# EAGLE design HBPB_FM_v4 (EAGLE 8.6.2)
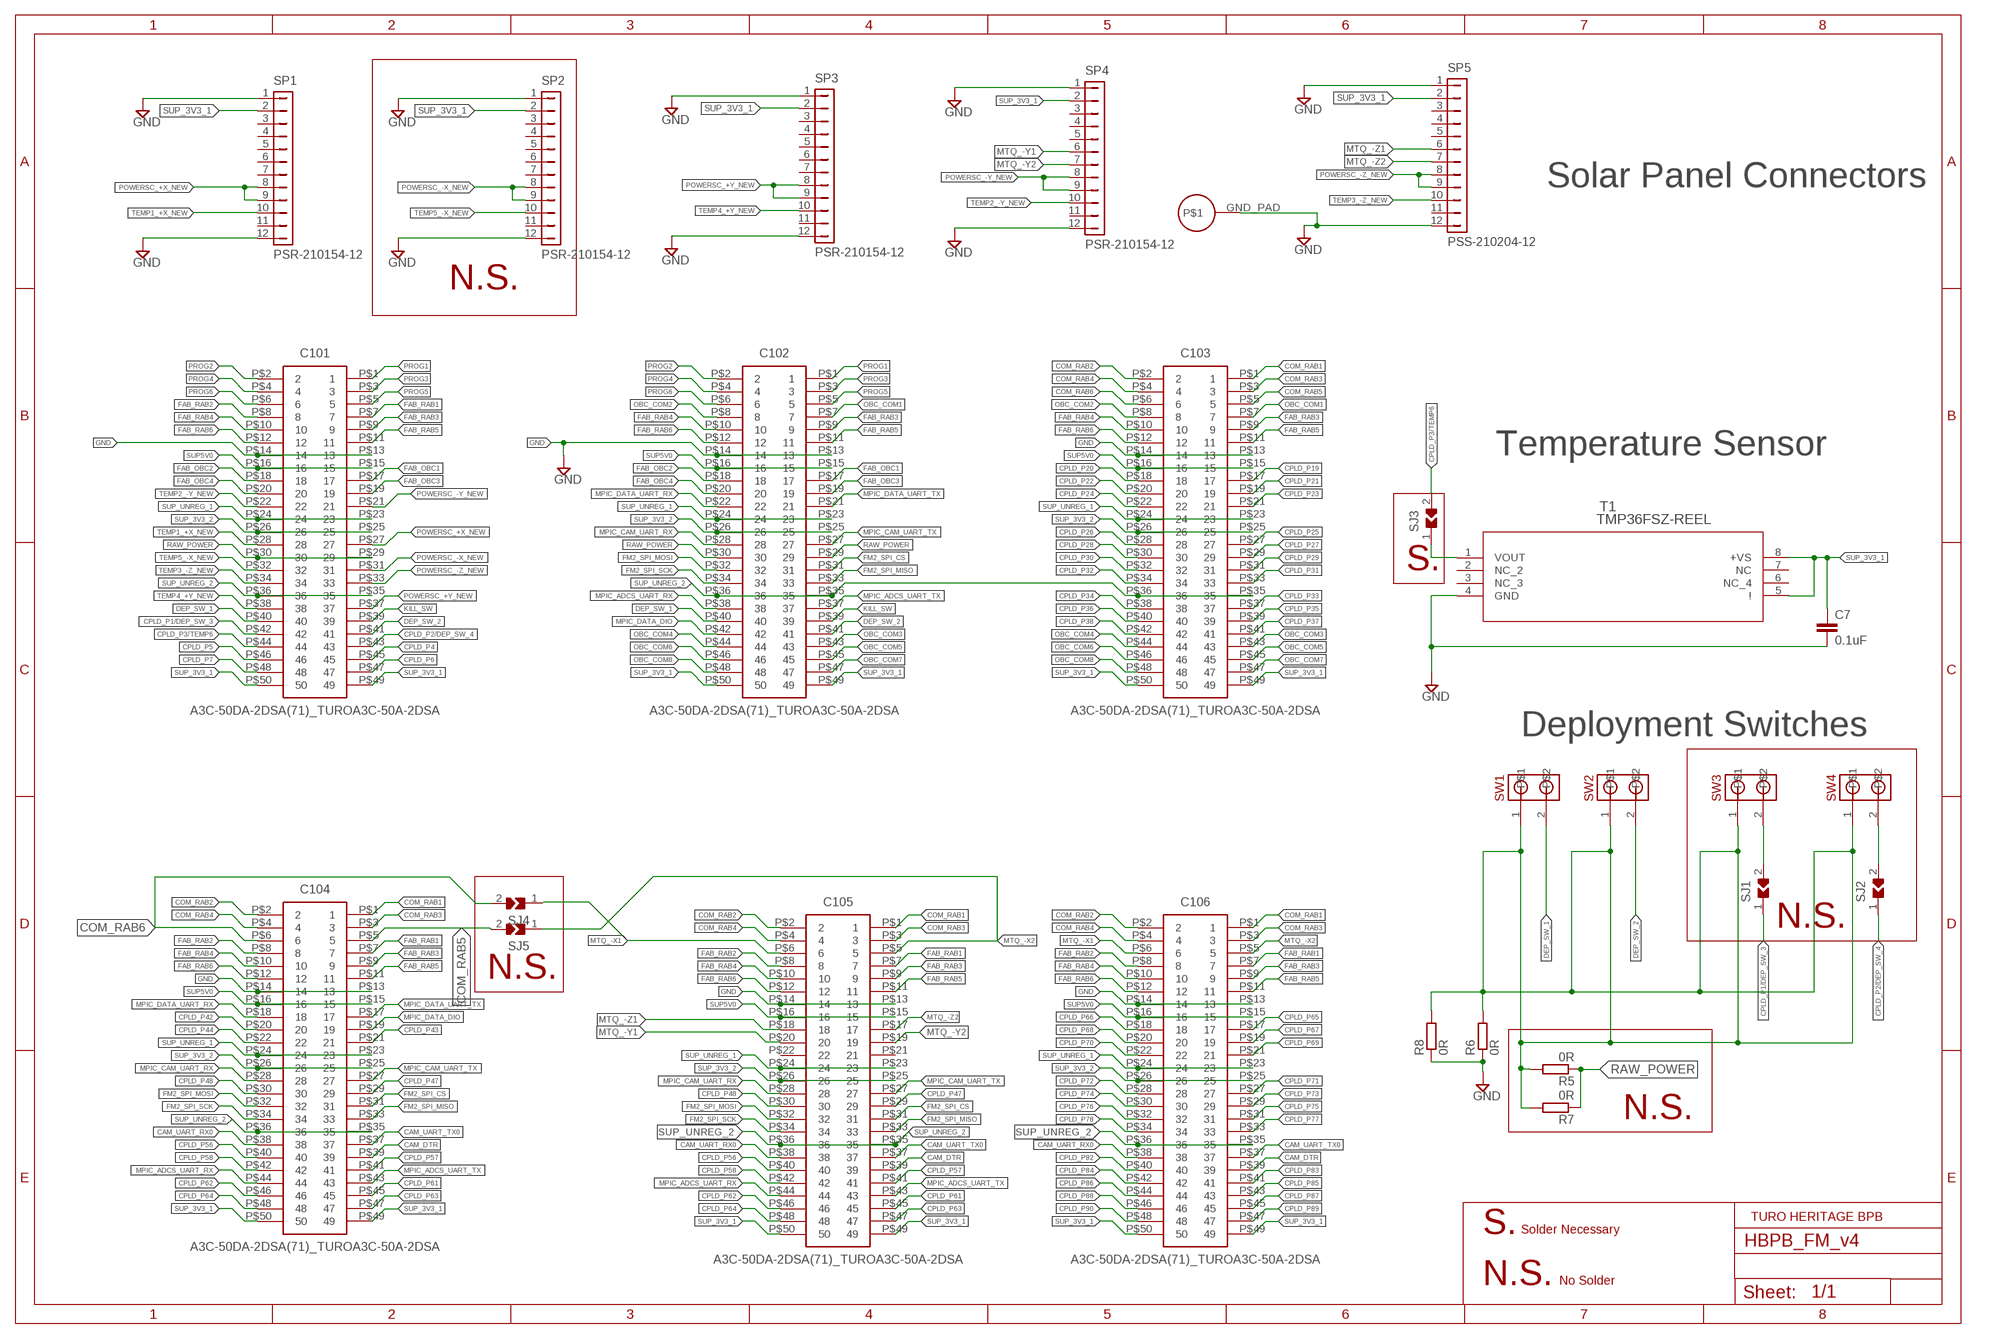
[diagram p0: schematic, sheet 1]

## Parts
C7  0.1uF  CC0402  [C0402]
C101  A3C-50DA-2DSA(71)_TUROA3C-50A-2DSA  [SHDR50W60P200_2X25_5000X400X44_TR]
C102  A3C-50DA-2DSA(71)_TUROA3C-50A-2DSA  [SHDR50W60P200_2X25_5000X400X44_TR]
C103  A3C-50DA-2DSA(71)_TUROA3C-50A-2DSA  [SHDR50W60P200_2X25_5000X400X44_TR]
C104  A3C-50DA-2DSA(71)_TUROA3C-50A-2DSA  [SHDR50W60P200_2X25_5000X400X44_TR]
C105  A3C-50DA-2DSA(71)_TUROA3C-50A-2DSA  [SHDR50W60P200_2X25_5000X400X44_TR]
C106  A3C-50DA-2DSA(71)_TUROA3C-50A-2DSA  [SHDR50W60P200_2X25_5000X400X44_TR]
R5  0R  RR3216  [R3216]
R6  0R  RR3216  [R3216]
R7  0R  RR3216  [R3216]
R8  0R  RR3216  [R3216]
SJ1  SJ_BY_TURO  [SJ_TURO]
SJ2  0R  SJ_BY_TURO  [SJ_TURO]
SJ3  SJ_BY_TURO  [SJ_TURO]
SJ4  SJ_BY_TURO  [SJ_TURO]
SJ5  SJ_BY_TURO  [SJ_TURO]
SP1  PSR-210154-12  [PIN1X12/90]
SP2  PSR-210154-12  [PIN1X12/90]
SP3  PSR-210154-12  [PIN1X12/90]
SP4  PSR-210154-12  [PIN1X12/90]
SP5  PSS-210204-12  [PIN1X12]
SW1  MOLEX-CONN-2-0554600272  [MOLEX-CONN-2-BIRDS]
SW2  MOLEX-CONN-2-0554600272  [MOLEX-CONN-2-BIRDS]
SW3  MOLEX-CONN-2-0554600272  [MOLEX-CONN-2-BIRDS]
SW4  MOLEX-CONN-2-0554600272  [MOLEX-CONN-2-BIRDS]
T1  TMP36FSZ-REEL  [R_8]
U$1  GND_PAD  [GND_PAD]

## Nets
CAM_DTR: C104.P$39 C105.P$39 C106.P$39
CAM_UART_RX0: C104.P$38 C105.P$38 C106.P$38
CAM_UART_TX0: C104.P$37 C105.P$37 C106.P$37
COM_RAB1: C103.P$1 C104.P$1 C105.P$1 C106.P$1
COM_RAB2: C103.P$2 C104.P$2 C105.P$2 C106.P$2
COM_RAB3: C103.P$3 C104.P$3 C105.P$3 C106.P$3
COM_RAB4: C103.P$4 C104.P$4 C105.P$4 C106.P$4
COM_RAB5: C103.P$5 C104.P$5 SJ5.2
COM_RAB6: C103.P$6 C104.P$6 SJ4.2
CPLD_P1/DEP_SW_3: C101.P$42 SJ1.1
CPLD_P2/DEP_SW_4: C101.P$43 SJ2.1
CPLD_P3/TEMP6: C101.P$44 SJ3.2
CPLD_P4: C101.P$45
CPLD_P5: C101.P$46
CPLD_P6: C101.P$47
CPLD_P7: C101.P$48
CPLD_P19: C103.P$17
CPLD_P20: C103.P$18
CPLD_P21: C103.P$19
CPLD_P22: C103.P$20
CPLD_P23: C103.P$21
CPLD_P24 [POWER]: C103.P$22
CPLD_P25: C103.P$27
CPLD_P26: C103.P$28
CPLD_P27: C103.P$29
CPLD_P28: C103.P$30
CPLD_P29: C103.P$31
CPLD_P30: C103.P$32
CPLD_P31: C103.P$33
CPLD_P32: C103.P$34
CPLD_P33: C103.P$37
CPLD_P34: C103.P$38
CPLD_P35: C103.P$39
CPLD_P36: C103.P$40
CPLD_P37: C103.P$41
CPLD_P38: C103.P$42
CPLD_P42: C104.P$20
CPLD_P43: C104.P$21
CPLD_P44: C104.P$22
CPLD_P47: C104.P$29 C105.P$29
CPLD_P48: C104.P$30 C105.P$30
CPLD_P56: C104.P$40 C105.P$40
CPLD_P57: C104.P$41 C105.P$41
CPLD_P58: C104.P$42 C105.P$42
CPLD_P61: C104.P$45 C105.P$45
CPLD_P62: C104.P$46 C105.P$46
CPLD_P63: C104.P$47 C105.P$47
CPLD_P64: C104.P$48 C105.P$48
CPLD_P65: C106.P$17
CPLD_P66: C106.P$18
CPLD_P67: C106.P$19
CPLD_P68: C106.P$20
CPLD_P69: C106.P$21
CPLD_P70: C106.P$22
CPLD_P71: C106.P$27
CPLD_P72: C106.P$28
CPLD_P73: C106.P$29
CPLD_P74: C106.P$30
CPLD_P75: C106.P$31
CPLD_P76: C106.P$32
CPLD_P77: C106.P$33
CPLD_P78: C106.P$34
CPLD_P82: C106.P$40
CPLD_P83: C106.P$41
CPLD_P84: C106.P$42
CPLD_P85: C106.P$43
CPLD_P86: C106.P$44
CPLD_P87: C106.P$45
CPLD_P88: C106.P$46
CPLD_P89: C106.P$47
CPLD_P90: C106.P$48
DEP_SW_1: C101.P$40 C102.P$40 SW1.2
DEP_SW_2: C101.P$41 C102.P$41 SW2.2
DEP_SW_POWER: R5.2 R6.2 R7.2 R8.2 SW1.1 SW2.1 SW3.1 SW4.1
FAB_OBC1: C101.P$17 C102.P$17
FAB_OBC2: C101.P$18 C102.P$18
FAB_OBC3: C101.P$19 C102.P$19
FAB_OBC4: C101.P$20 C102.P$20
FAB_RAB1: C101.P$7 C104.P$7 C105.P$7 C106.P$7
FAB_RAB2: C101.P$8 C104.P$8 C105.P$8 C106.P$8
FAB_RAB3: C101.P$9 C102.P$9 C103.P$9 C104.P$9 C105.P$9 C106.P$9
FAB_RAB4: C101.P$10 C102.P$10 C103.P$10 C104.P$10 C105.P$10 C106.P$10
FAB_RAB5: C101.P$11 C102.P$11 C103.P$11 C104.P$11 C105.P$11 C106.P$11
FAB_RAB6: C101.P$12 C102.P$12 C103.P$12 C104.P$12 C105.P$12 C106.P$12
FM2_SPI_CS: C102.P$31 C104.P$31 C105.P$31
FM2_SPI_MISO: C102.P$33 C104.P$33 C105.P$33
FM2_SPI_MOSI: C102.P$32 C104.P$32 C105.P$32
FM2_SPI_SCK: C102.P$34 C104.P$34 C105.P$34
GND [GND]: C7.2 C101.P$13 C101.P$14 C102.P$13 C102.P$14 C103.P$13 C103.P$14 C104.P$13 C104.P$14 C105.P$13 C105.P$14 C106.P$13 C106.P$14 R6.1 R8.1 SP1.1 SP1.12 SP2.1 SP2.12 SP3.1 SP3.12 SP4.1 SP4.12 SP5.1 SP5.12 T1.4(GND) U$1.GND_PAD
KILL_SW: C101.P$39 C102.P$39
MPIC_ADCS_UART_RX: C102.P$38 C104.P$44 C105.P$44
MPIC_ADCS_UART_TX: C102.P$37 C104.P$43 C105.P$43
MPIC_CAM_UART_RX: C102.P$28 C104.P$28 C105.P$28
MPIC_CAM_UART_TX: C102.P$27 C104.P$27 C105.P$27
MPIC_DATA_DIO: C102.P$42 C104.P$19
MPIC_DATA_UART_RX: C102.P$22 C104.P$18
MPIC_DATA_UART_TX: C102.P$21 C104.P$17
MTQ_-X1: C105.P$6 C106.P$6 SJ4.1
MTQ_-X2: C105.P$5 C106.P$5 SJ5.1
MTQ_-Y1: C105.P$20 SP4.6
MTQ_-Y2: C105.P$19 SP4.7
MTQ_-Z1: C105.P$18 SP5.6
MTQ_-Z2: C105.P$17 SP5.7
N$8: SJ2.2 SW4.2
N$9: SJ1.2 SW3.2
N$13: SJ3.1 T1.1(VOUT)
OBC_COM1: C102.P$7 C103.P$7
OBC_COM2: C102.P$8 C103.P$8
OBC_COM3: C102.P$43 C103.P$43
OBC_COM4: C102.P$44 C103.P$44
OBC_COM5: C102.P$45 C103.P$45
OBC_COM6: C102.P$46 C103.P$46
OBC_COM7: C102.P$47 C103.P$47
OBC_COM8: C102.P$48 C103.P$48
POWERSC_+X_NEW [POWER]: C101.P$27 SP1.8 SP1.9
POWERSC_+Y_NEW [POWER]: C101.P$37 SP3.8 SP3.9
POWERSC_-X_NEW [POWER]: C101.P$31 SP2.8 SP2.9
POWERSC_-Y_NEW [POWER]: C101.P$21 SP4.8 SP4.9
POWERSC_-Z_NEW [POWER]: C101.P$33 SP5.8 SP5.9
PROG1: C101.P$1 C102.P$1
PROG2: C101.P$2 C102.P$2
PROG3: C101.P$3 C102.P$3
PROG4: C101.P$4 C102.P$4
PROG5: C101.P$5 C102.P$5
PROG6: C101.P$6 C102.P$6
RAW_POWER: C101.P$29 C101.P$30 C102.P$29 C102.P$30 R5.1 R7.1
SUP5V0 [POWER]: C101.P$15 C101.P$16 C102.P$15 C102.P$16 C103.P$15 C103.P$16 C104.P$15 C104.P$16 C105.P$15 C105.P$16 C106.P$15 C106.P$16
SUP_3V3_1 [POWER]: C7.1 C101.P$49 C101.P$50 C102.P$49 C102.P$50 C103.P$49 C103.P$50 C104.P$49 C104.P$50 C105.P$49 C105.P$50 C106.P$49 C106.P$50 SP1.2 SP2.2 SP3.2 SP4.2 SP5.2 T1.5(!) T1.8(+VS)
SUP_3V3_2 [POWER]: C101.P$25 C101.P$26 C102.P$25 C102.P$26 C103.P$25 C103.P$26 C104.P$25 C104.P$26 C105.P$25 C105.P$26 C106.P$25 C106.P$26
SUP_UNREG_1 [POWER]: C101.P$23 C101.P$24 C102.P$23 C102.P$24 C103.P$23 C103.P$24 C104.P$23 C104.P$24 C105.P$23 C105.P$24 C106.P$23 C106.P$24
SUP_UNREG_2 [POWER]: C101.P$35 C101.P$36 C102.P$35 C102.P$36 C103.P$35 C103.P$36 C104.P$35 C104.P$36 C105.P$35 C105.P$36 C106.P$35 C106.P$36
TEMP1_+X_NEW: C101.P$28 SP1.10
TEMP2_-Y_NEW: C101.P$22 SP4.10
TEMP3_-Z_NEW: C101.P$34 SP5.10
TEMP4_+Y_NEW: C101.P$38 SP3.10
TEMP5_-X_NEW: C101.P$32 SP2.10
Unconnected: C105.P$21 C105.P$22 SP1.3 SP1.4 SP1.5 SP1.6 SP1.7 SP1.11 SP2.3 SP2.4 SP2.5 SP2.6 SP2.7 SP2.11 SP3.3 SP3.4 SP3.5 SP3.6 SP3.7 SP3.11 SP4.3 SP4.4 SP4.5 SP4.11 SP5.3 SP5.4 SP5.5 SP5.11 T1.2(NC_2) T1.3(NC_3) T1.6(NC_4) T1.7(NC)

## Notes on the sheet
- Solar Panel Connectors
- N.S.
- Temperature Sensor
- S.
- Deployment Switches
- N.S.
- N.S.
- N.S.
- TURO HERITAGE BPB
- S. | Solder Necessary
- N.S. | No Solder

## Library data of the parts
C7 = Turo_collection:C: CAPACITOR, European symbol; SPICEMODEL: NONE; SPICEPREFIX: C
C101-C106 = Turo_collection:A3C-50DA-2DSA(71)_TURO: Hirose A3C Series 2mm 50 Way 2 Row Straight PCB Socket Through Hole Board to Wire <http://uk.rs-online.com/largeimages/R7793068-01.jpg> Source: Datasheet <https://www.google.co.uk/url?sa=t&rct=j&q=&esrc=s&source=web&cd=5&ved=0ahUKEwiW7Ov7l8PWAhUDCsAKHbxmCjsQFgg9MAQ&url=https://www.hirose.com/product/en/download_file/key_name/A3/category/Catalog/doc_file_id/49521/?file_category_id>
R5-R8 = Turo_collection:R: RESISTOR, European symbol; SPICEMODEL: NONE; SPICEPREFIX: R
SJ1-SJ5 = Turo_collection:SJ_BY_TURO
SP1-SP4 = Turo_collection:PSR-210154-12
SP5 = Turo_collection:PSS-210204-12: Used for -Z panel on the backplane Created by Turo - 2018
SW1-SW4 = Turo_collection:MOLEX-CONN-2-0554600272
T1 = Turo_collection:TMP36FSZ-REEL; MANUFACTURER_PART_NUMBER: TMP36FSZREEL; VENDOR: Analog Devices Inc
U$1 = Turo_collection:GND_PAD

## Net classes
1 GND: width 0.2 mm, clearance 0.127 mm
2 POWER: width 0.2 mm, clearance 0.02 mm

## Board
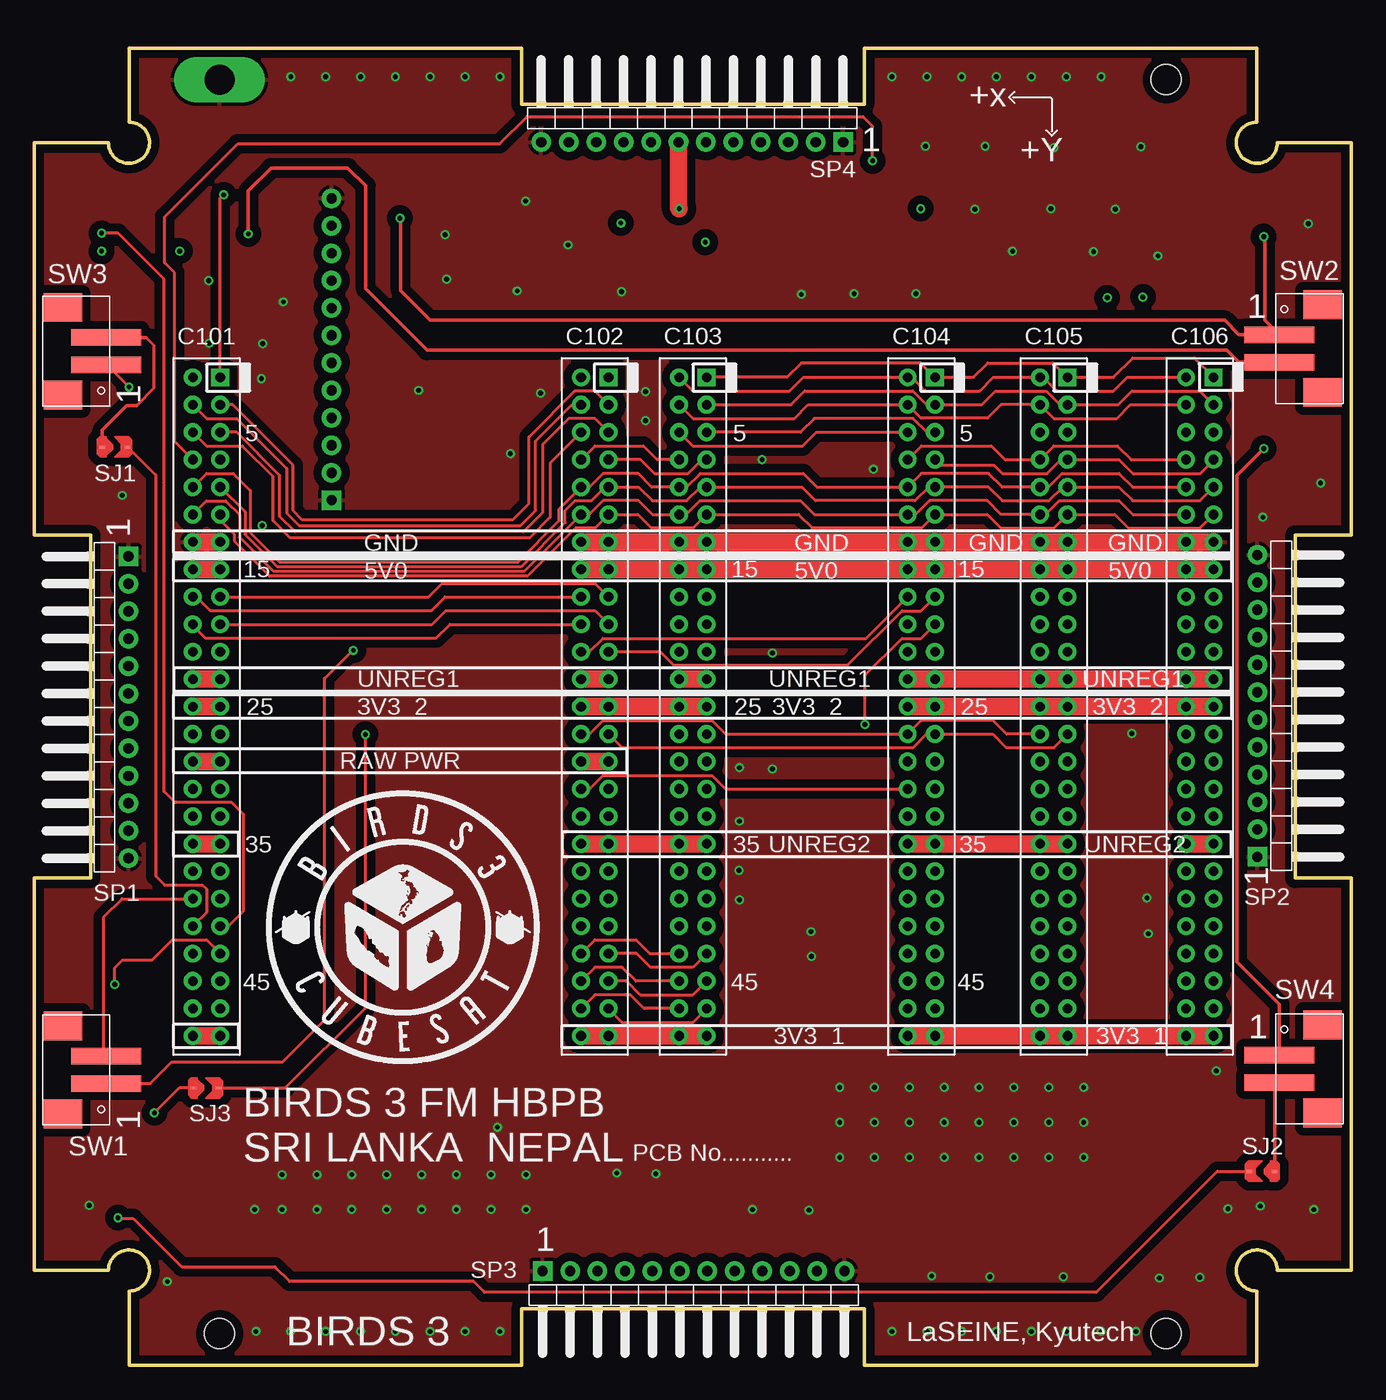
[diagram p1: board, top side]
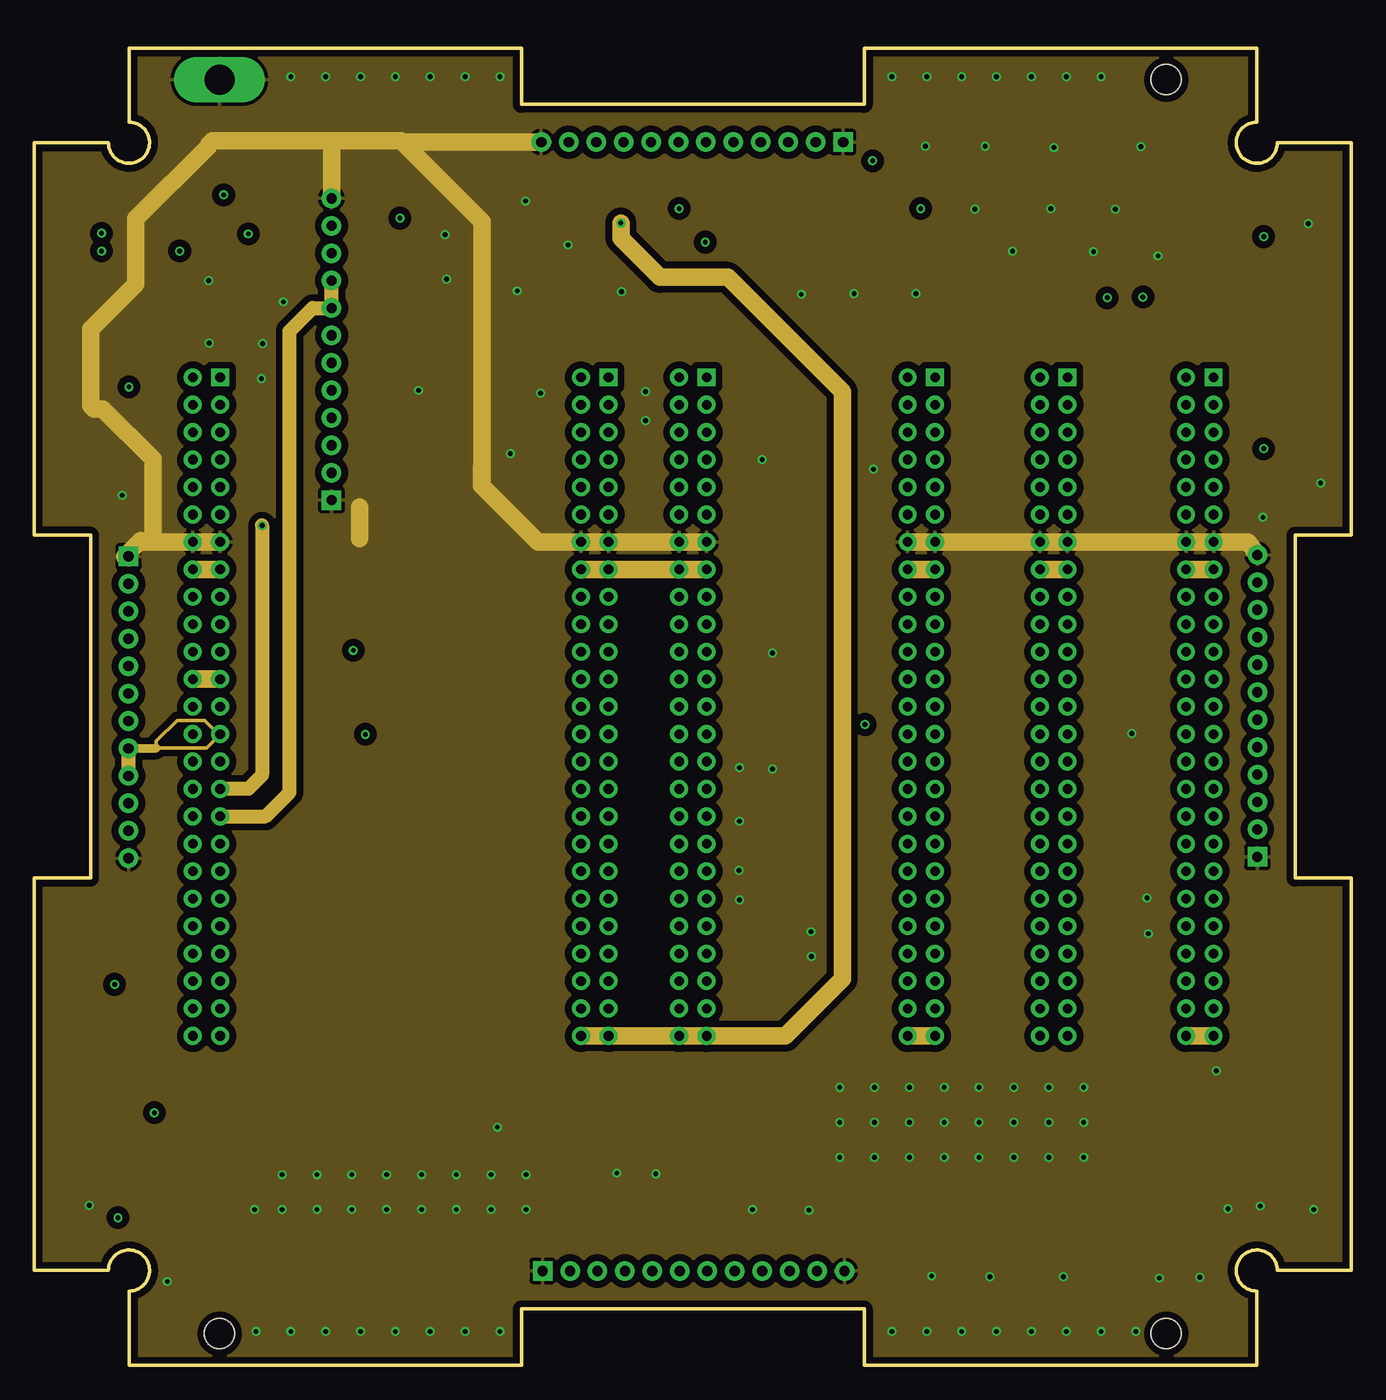
[diagram p2: board, inner layer L2_GND]
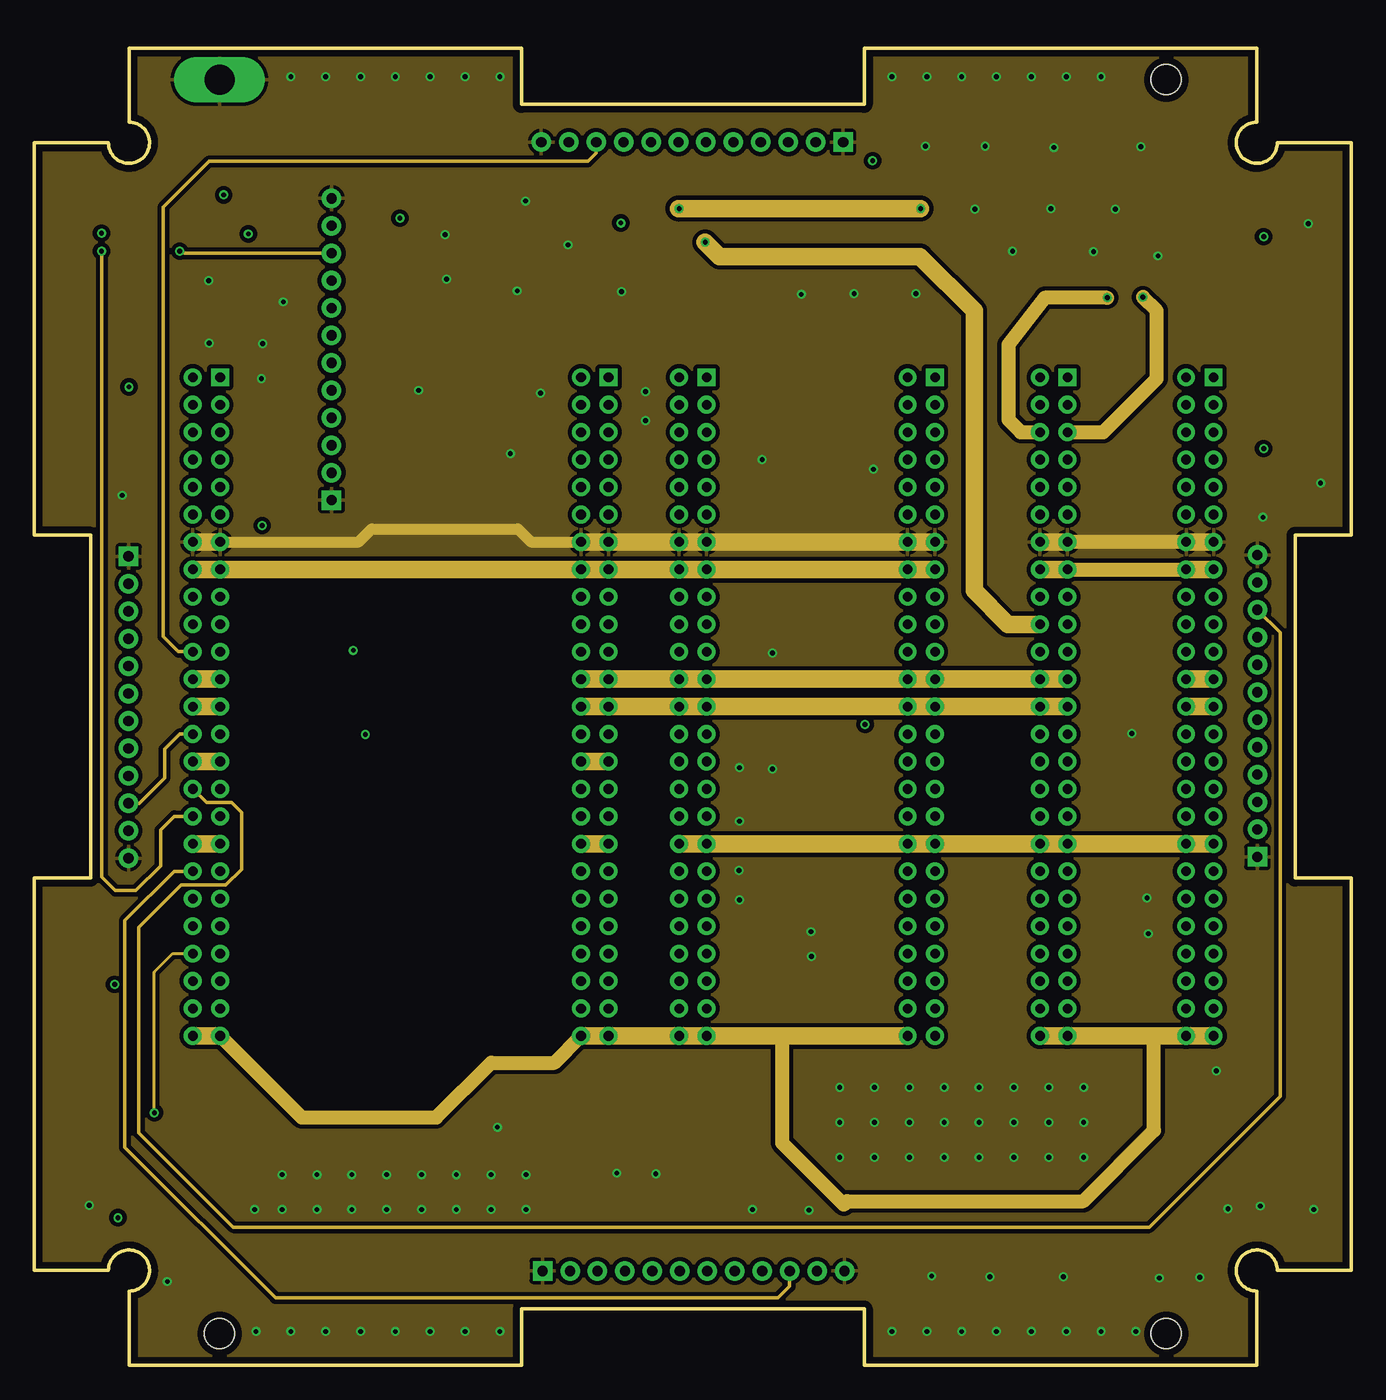
[diagram p3: board, inner layer L3]
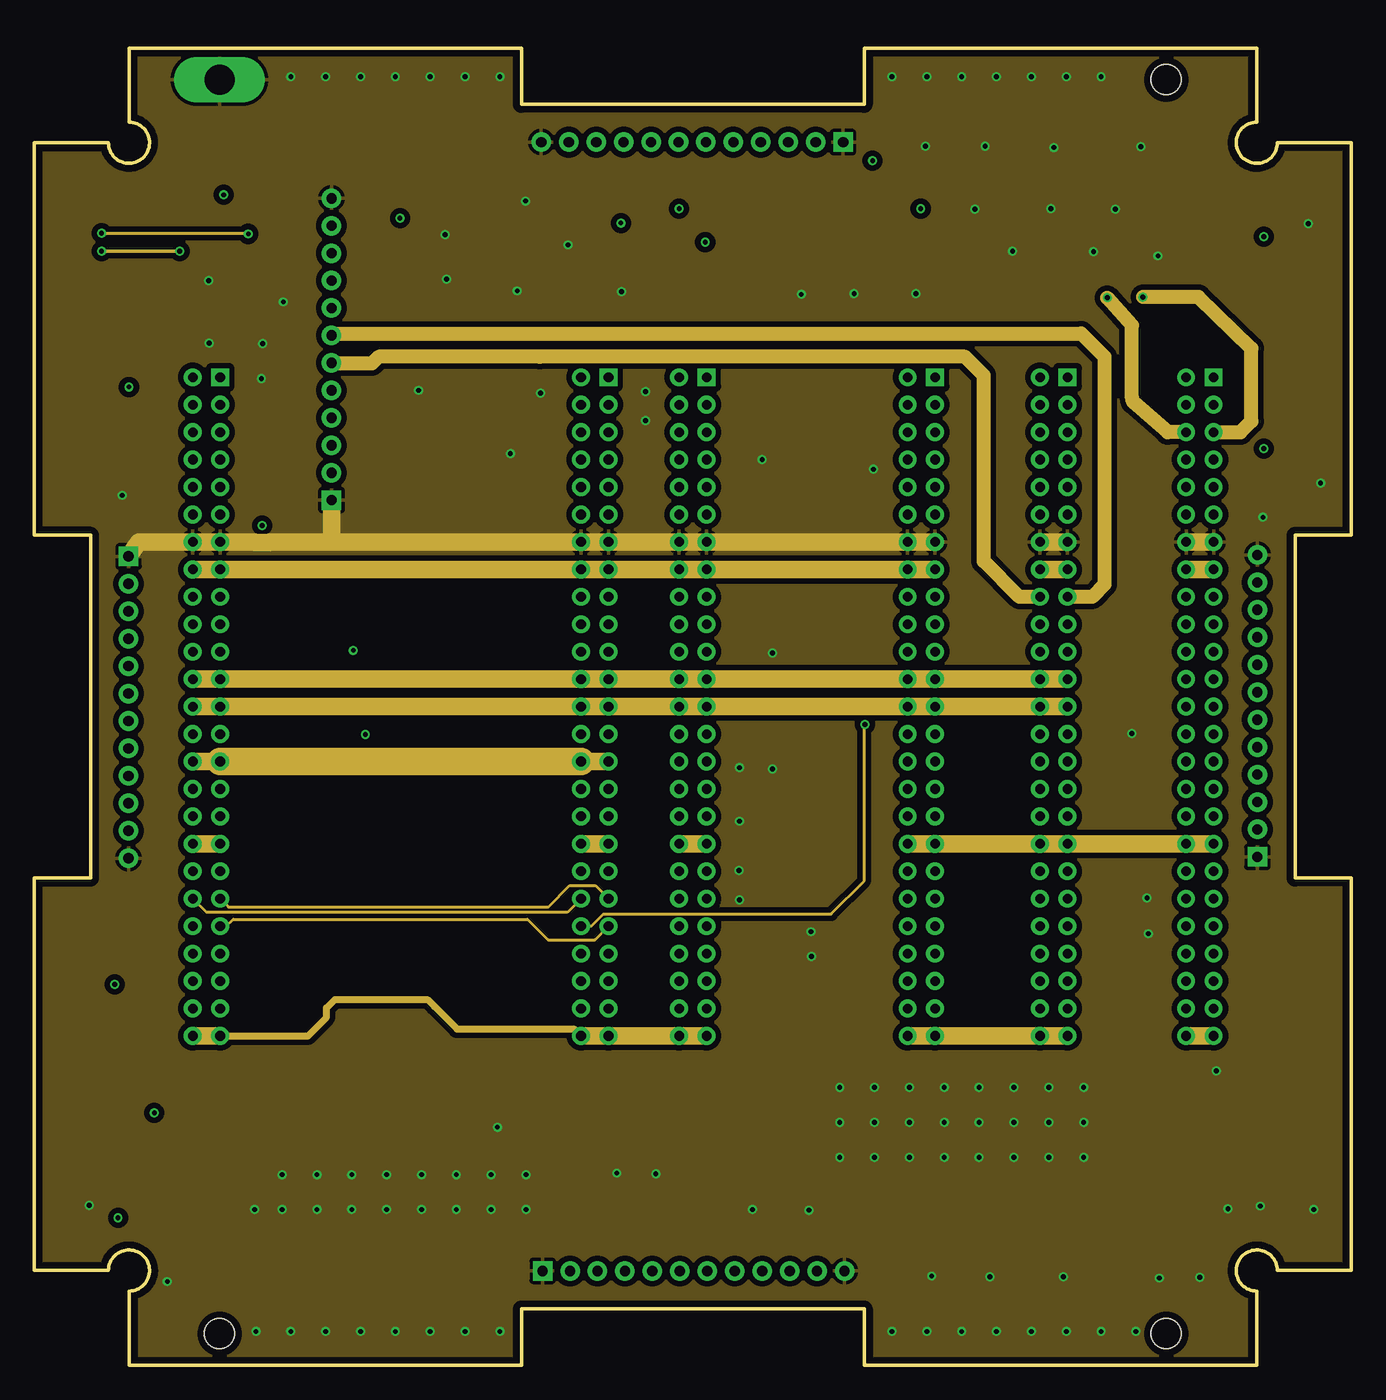
[diagram p4: board, inner layer L4]
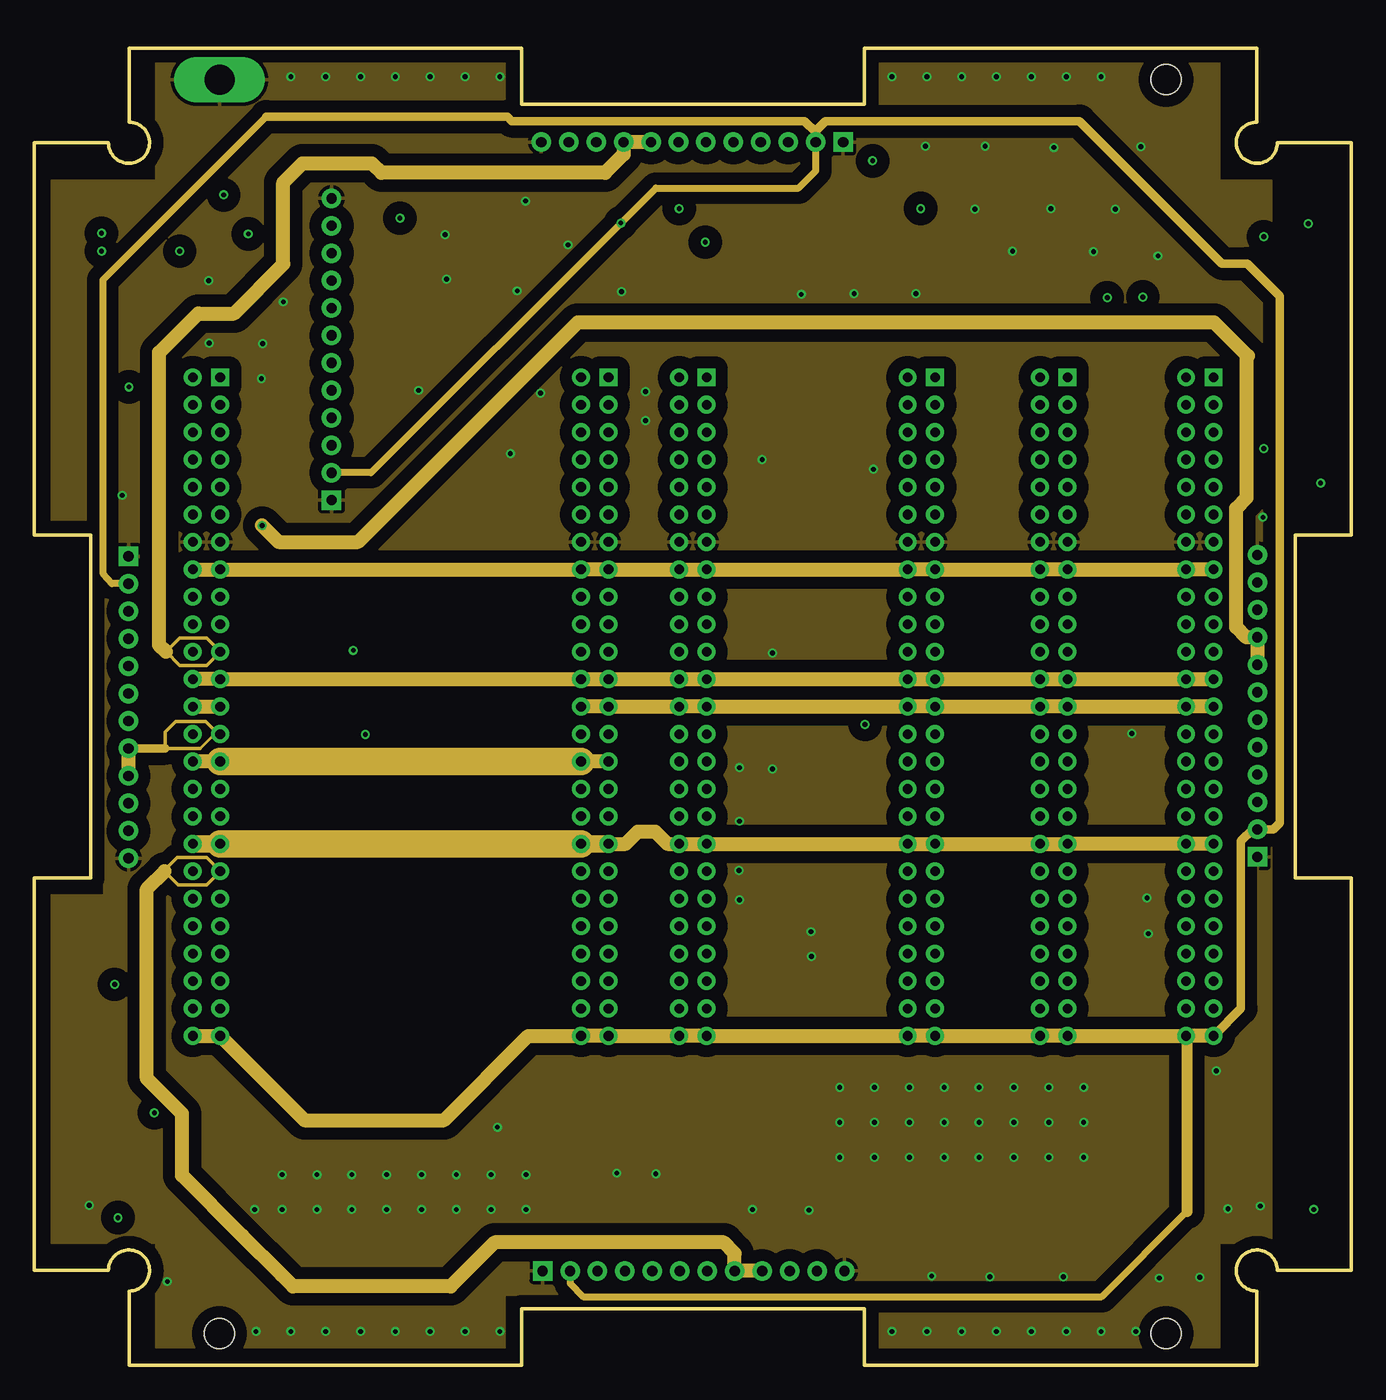
[diagram p5: board, inner layer L5_VCC]
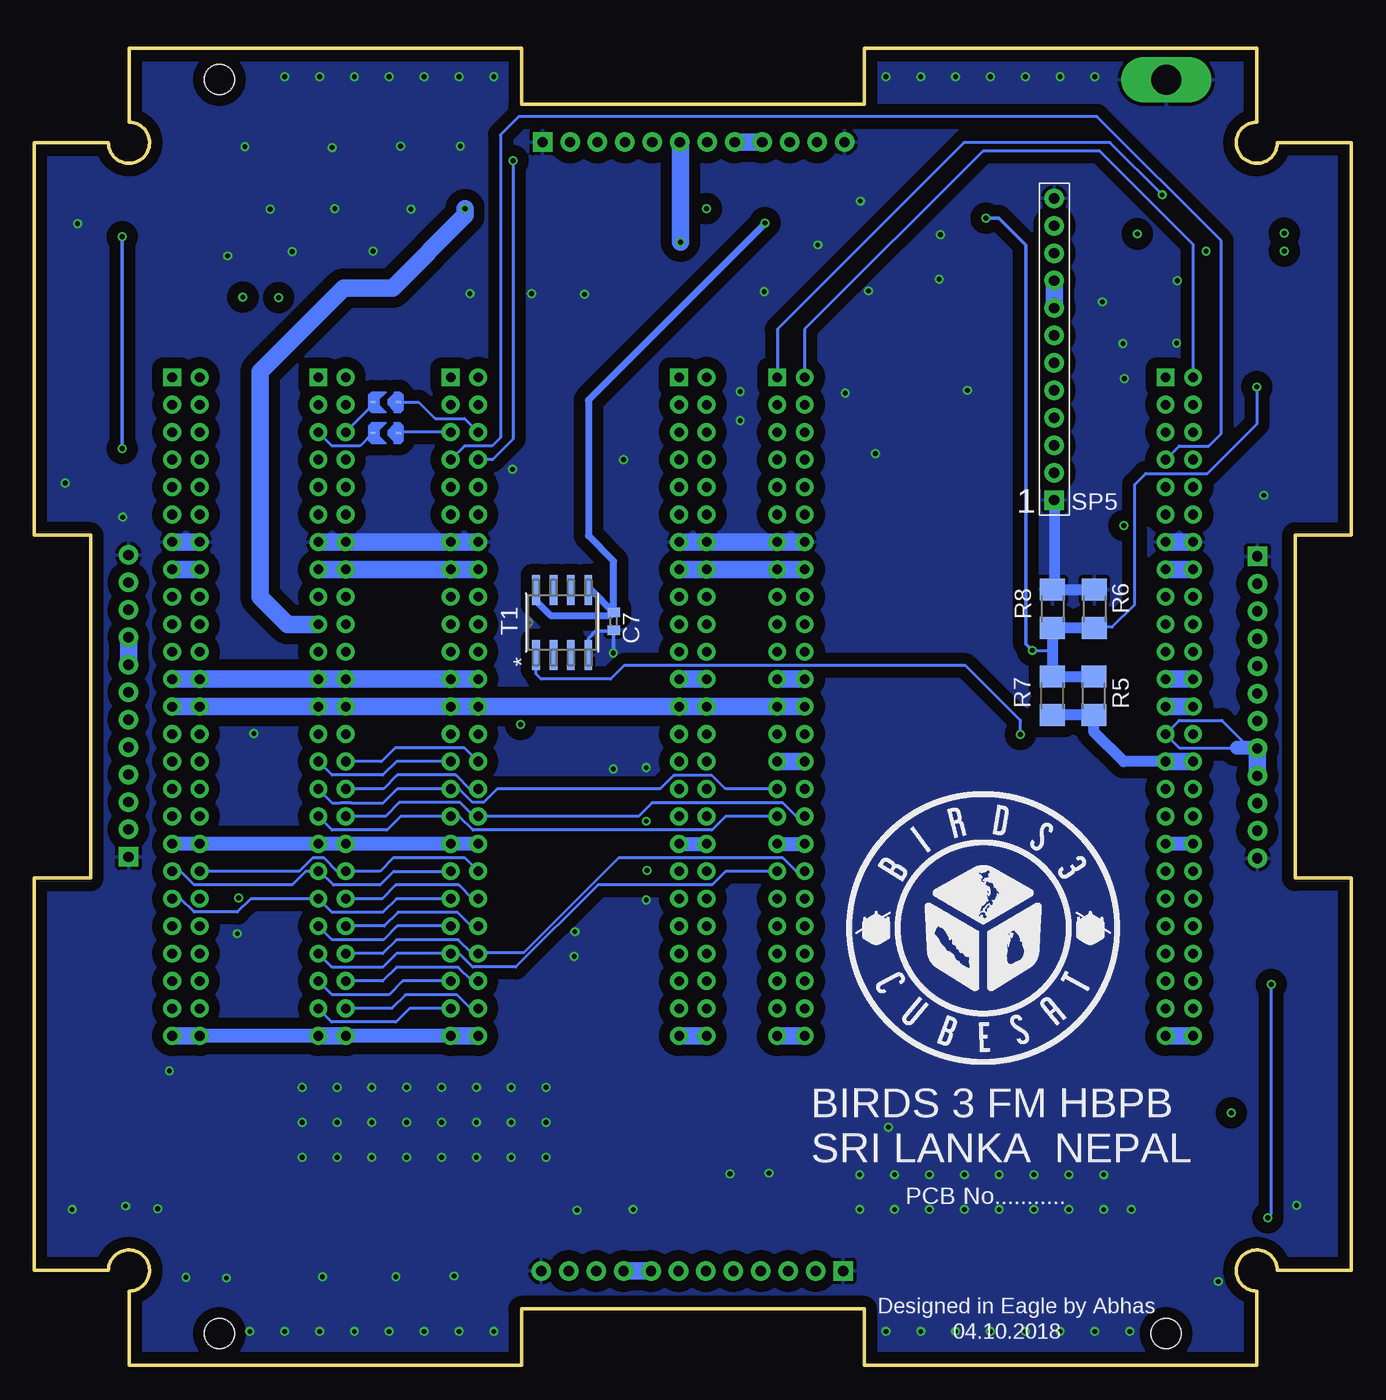
[diagram p6: board, bottom side, seen from below]

Size 96 x 96 mm. Coordinates in mm from the lower left corner, seen from the top.
Outline: 0,6.9 0,35.5 4.1,35.5 4.1,60.5 0,60.5 0,89.1 5.4,89.1 arc270 6.9,90.6 6.9,96 35.5,96 35.5,91.9 60.5,91.9 60.5,96 89.1,96 89.1,90.6 arc270 90.6,89.1 96,89.1 96,60.5 91.9,60.5 91.9,35.5 96,35.5 96,6.9 90.6,6.9 arc270 89.1,5.4 89.1,0 60.5,0 60.5,4.1 35.5,4.1 35.5,0 6.9,0 6.9,5.4 arc270 5.4,6.9 0,6.9
Copper layers (1+2*3*5*15+16): L1 0.018mm / dielectric 0.25mm / L2_GND 0.035mm / dielectric 0.25mm / L3 0.035mm / dielectric 0.2mm / L4 0.035mm / dielectric 0.2mm / L5_VCC 0.035mm / dielectric 0.25mm / L6 0.018mm
Design rules "pban_5mil_l4 *": minimum track width 5mil, minimum drill 0.3mm, track to track 5mil, track to pad 0.229mm, pad to pad 5mil, via to via 5mil, smd to smd 5mil, copper to edge 0.5mm, drill to drill 0.5mm, minimum pad ring 0.15mm, minimum via ring 0.15mm, stop-mask expansion 4mil, vias tented up to drill 0.35mm, thermal gap 10mil
Holes 2.2 mm at 13.5,2.3 82.5,2.3 82.5,93.7

### Footprints (pad centres in the part's own frame; a part is rotated, then mirrored left to right if it is on the bottom)
C0402 = smd 0.7 x 0.9: 1 -0.65,0; 2 0.65,0
SHDR50W60P200_2X25_5000X400X44_TR = drill 0.7 pad 1.3 square: P$1 0,2 | drill 0.7 pad 1.3: P$2 0,0; P$3 2,2; P$4 2,0; P$5 4,2; P$6 4,0; P$7 6,2; P$8 6,0; P$9 8,2; P$10 8,0; P$11 10,2; P$12 10,0; P$13 12,2; P$14 12,0; P$15 14,2; P$16 14,0; P$17 16,2; P$18 16,0; P$19 18,2; P$20 18,0; P$21 20,2; P$22 20,0; P$23 22,2; P$24 22,0; P$25 24,2; P$26 24,0; P$27 26,2; P$28 26,0; P$29 28,2; P$30 28,0; P$31 30,2; P$32 30,0; P$33 32,2; P$34 32,0; P$35 34,2; P$36 34,0; P$37 36,2; P$38 36,0; P$39 38,2; P$40 38,0; P$41 40,2; P$42 40,0; P$43 42,2; P$44 42,0; P$45 44,2; P$46 44,0; P$47 46,2; P$48 46,0; P$49 48,2; P$50 48,0
R3216 = smd 1.6 x 1.8: 1 -1.4,0; 2 1.4,0
SJ_TURO = smd 0.406 x 0.203: 1 -0.7,0; 2 1.15,0
PIN1X12/90 = drill 0.75 pad 1.422 square: 1 -0.048,-0.063 | drill 0.75 pad 1.422: 2 -2.048,-0.063; 3 -4.048,-0.063; 4 -6.048,-0.063; 5 -8.048,-0.063; 6 -10.048,-0.063; 7 -12.048,-0.063; 8 -14.048,-0.063; 9 -16.048,-0.063; 10 -18.048,-0.063; 11 -20.048,-0.063; 12 -22.048,-0.063
PIN1X12 = drill 0.75 pad 1.422 square: 1 -0.048,-0.063 | drill 0.75 pad 1.422: 2 -2.048,-0.063; 3 -4.048,-0.063; 4 -6.048,-0.063; 5 -8.048,-0.063; 6 -10.048,-0.063; 7 -12.048,-0.063; 8 -14.048,-0.063; 9 -16.048,-0.063; 10 -18.048,-0.063; 11 -20.048,-0.063; 12 -22.048,-0.063
MOLEX-CONN-2-BIRDS = smd 1.2 x 5.1: 1 2.6,2.55; 2 0.6,2.55 | smd 2.1 x 2.8: P$3 -1.6,-0.6; P$4 4.8,-0.6
R_8 = smd 2.184 x 0.559: 1 -2.362,1.905; 2 -2.362,0.635; 3 -2.362,-0.635; 4 -2.362,-1.905; 5 2.362,-1.905; 6 2.362,-0.635; 7 2.362,0.635; 8 2.362,1.905
GND_PAD = drill 2.2 pad 3.3 long: GND_PAD 0,0

### Placement (x,y rotation side)
C7  53.77,54.23 270 bottom
C101  11.55,72 270 top
C102  39.85,72 270 top
C103  47,72 270 top
C104  63.65,72 270 top
C105  73.3,72 270 top
C106  83.95,72 270 top
R5  18.77,48.8 90 bottom
R6  18.74,55.12 270 bottom
R7  21.8,48.8 90 bottom
R8  21.8,55.12 270 bottom
SJ1  6.1,66.92 180 top
SJ2  89.25,14.14 0 top
SJ3  12.74,20.2 180 top
SJ4  70.62,70.19 0 bottom
SJ5  70.62,67.94 0 bottom
SP1  6.8,59 90 top
SP2  89.2,37 270 top
SP3  37,6.8 180 top
SP4  59,89.2 0 top
SP5  21.6,63 270 bottom
SW1  2.7,23.12 270 top
SW2  93.3,72.5 90 top
SW3  2.7,75.5 270 top
SW4  93.3,20 90 top
T1  57.52,54.12 90 bottom
U$1  13.5,93.7 0 top

### Tracks (layer width: path | path; a pad name or v marks a point on that pad's centre or on a via)
CAM_DTR
  L6 0.203: C104.P$39 69.6,34 70.6,33 74.3,33 C105.P$39 80.22,34 81.2,33.02 84.36,33.02 85.34,34 C106.P$39
CAM_UART_RX0
  L6 0.203: C104.P$38 64.65,37 69.8,37 70.8,36 C105.P$38 73.91,36 74.89,36.98 75.71,36.98 76.69,36 C106.P$38
CAM_UART_TX0
  L6 0.203: C104.P$37 69.8,36 70.8,35 74.2,35 75.2,36 C105.P$37 76.22,36 77.2,35.02 84.36,35.02 85.34,36 C106.P$37
COM_RAB1
  L1 0.203: C103.P$1 54.85,72 55.9,73.05 64.6,73.05 C104.P$1 68.45,72 69.5,73.05 74.25,73.05 C105.P$1 78.65,72 80.05,73.4 84.55,73.4 C106.P$1
COM_RAB2
  L1 0.203: C103.P$2 48,71 55.05,71 56.05,72 C104.P$2 63.95,72 64.67,71.28 64.67,71.21 64.86,71.02 64.93,71.02 64.95,71 68.9,71 69.9,72 C105.P$2 73.55,72 74.32,71.23 74.32,71.21 74.51,71.02 74.53,71.02 74.55,71 78.65,71 79.65,72 C106.P$2
COM_RAB3
  L1 0.203: C103.P$3 55.15,70 56.15,71 64.04,71 65.04,70 C104.P$3 69.05,70 70.03,70.98 73.75,70.98 74.73,70 C105.P$3 79,70 80,71 84.95,71 C106.P$3
COM_RAB4
  L1 0.203: C103.P$4 48,69 55.4,69 56.4,70 C104.P$4 64.63,69.02 69.47,69.02 70.45,70 C105.P$4 74.3,69 78.9,69 79.9,70 C106.P$4
COM_RAB5
  L1 0.203: C103.P$5 55.85,68 56.85,69 64.05,69 65.05,68 C104.P$5
  L6 0.203: C104.P$5 69.41,68 SJ5.2
COM_RAB6
  L1 0.203: C103.P$6 48,67 56,67 57,68 C104.P$6
  L6 0.203: SJ4.2 67.99,70.19 66.8,69 64.65,69 C104.P$6
CPLD_P1/DEP_SW_3
  L1 0.203: SJ1.1 8.85,64.88 8.85,35.65 9.5,35 12.25,35 12.55,34.7 12.55,33 C101.P$42
CPLD_P2/DEP_SW_4  (via drill 0.35)
  L1 0.203: v6.1,10.75 6.15,10.7 7.2,10.7 10.72,7.17 17.52,7.17 18.6,6.1 32,6.1 32.8,5.3 77.4,5.3 86.24,14.14 SJ2.1 | v5.85,27.75 5.85,28.95 6.42,29.52 8.57,29.52 10.05,31 12.55,31 C101.P$43
  L6 0.203: 5.9,27.7 v5.85,27.75 5.85,11 v6.1,10.75
CPLD_P3/TEMP6  (via drill 0.35)
  L1 0.203: 11.54,20.15 SJ3.2 10.55,20.2 v8.75,18.4
  L3 0.203: v8.75,18.4 8.75,28.65 10.1,30 C101.P$44
CPLD_P47
  L6 0.203: C104.P$29 69.6,44 70.6,43 74.3,43 C105.P$29
CPLD_P48
  L6 0.203: C104.P$30 64.65,45 69.7,45 70.7,44 C105.P$30
CPLD_P56
  L6 0.203: C104.P$40 64.05,34 65.05,35 69.65,35 70.65,34 C105.P$40
CPLD_P57
  L6 0.203: C105.P$41 74.3,31 70.55,31 69.55,32 C104.P$41
CPLD_P58
  L6 0.203: C105.P$42 70.5,32 69.5,33 65.15,33 64.15,32 C104.P$42
CPLD_P61
  L6 0.203: C104.P$45 69.15,28 70.15,27 74.3,27 C105.P$45
CPLD_P62
  L6 0.203: C104.P$46 64.1,28 65.1,29 69.6,29 70.6,28 C105.P$46
CPLD_P63
  L6 0.203: C104.P$47 68.65,26 69.63,25.02 74.32,25.02 C105.P$47
CPLD_P64
  L6 0.203: C104.P$48 64.2,26 65.2,27 68.95,27 69.95,26 C105.P$48
DEP_SW_1
  L1 0.203: C101.P$40 6.4,34 5.03,32.62 5.03,22.75 SW1.2
  L4 0.203: C101.P$40 12.55,33 37.2,33 37.21,33.01 37.79,33.01 37.8,33 38.85,33 C102.P$40
DEP_SW_2  (via drill 0.35)
  L1 0.203: C101.P$41 14.15,32 15.25,33.1 15.25,40.15 14.4,41 10.25,41 9.45,41.8 9.45,64.25 | 9.45,64.25 9.4,64.3 | 9.45,64.25 9.45,79.15 6.1,82.5 v4.9,82.5
  L1 0.254: SW2.2 87.8,73.1 86.92,73.97 28.62,73.97 24.15,78.45 24.15,85.95 22.85,87.25 17.25,87.25 15.6,85.6 v15.6,82.45
  L4 0.203: C101.P$41 14,32 14.5,32.5 35.95,32.5 37.45,31 40.85,31 C102.P$41 | v15.6,82.45 15.55,82.5 v4.9,82.5
DEP_SW_POWER  (via drill 0.35)
  L1 0.203: v6.9,71.3 5.3,72.9 SW3.1 | SW1.1 8.45,20.52 10.03,22.1 17.14,22.1 | v23.25,52.1 23.2,52.1 21.15,50.05 21.15,25.15 18.1,22.1 17.14,22.1 | 17.14,22.1
  L1 0.254: v26.65,83.6 26.65,83.55 26.7,83.5 26.7,78.3 28.85,76.15 86.75,76.15 87.8,75.1 SW2.1 89.7,76.15 89.7,82.15 v89.6,82.25 | v89.6,66.8 87.65,64.85 87.65,29.4 90.75,26.3 SW4.1
  L6 0.203: R6.2 18.66,53.8 17.45,53.8 15.8,55.45 15.8,64.2 15,65 10.5,65 6.9,68.6 v6.9,71.3 | v23.25,52.1 21.8,52.1
  L6 0.254: v89.6,82.25 v89.6,66.8 | v23.25,52.1 23.73,52.58 23.73,81.62 25.7,83.6 v26.65,83.6
  L6 0.813: R6.2 R8.2 21.8,52.1 R7.2 R5.2
FAB_OBC1
  L1 0.203: C101.P$17 28.75,56 29.73,56.98 40.87,56.98 C102.P$17
FAB_OBC2
  L1 0.203: C101.P$18 11.85,56 12.83,55.02 28.95,55.02 29.93,56 C102.P$18
FAB_OBC3
  L1 0.203: C101.P$19 29,54 30,55 40.85,55 C102.P$19
FAB_OBC4
  L1 0.203: C101.P$20 11.55,53.9 12.45,53 29.3,53 30.3,54 C102.P$20
FAB_RAB1
  L1 0.203: C106.P$7 85.95,65.95 85,65 80.05,65 79.05,66 C105.P$7 74.83,66 73.81,64.98 70.57,64.98 69.95,65.6 66.05,65.6 C104.P$7
  L6 0.203: C101.P$7 12.55,67 10.4,67 9.5,67.9 9.5,81.95 18.55,91 60.7,91 62.02,89.67 62.02,67.62 62.65,67 64.65,67 C104.P$7
FAB_RAB2  (via drill 0.35)
  L1 0.203: v61.1,87.78 61.1,90.3 60.4,91 55.12,91 35.9,91 33.92,89.03 14.82,89.03 9.5,83.7 9.5,80.35 10.22,79.62 10.22,67.33 C101.P$8 | C106.P$8 79.95,66 78.95,67 74.3,67 C105.P$8 70.75,66 69.75,67 64.65,67 C104.P$8
  L6 0.203: C104.P$8 62.6,66 61.1,67.5 v61.1,87.78
FAB_RAB3
  L1 0.203: C101.P$9 15.35,62.2 15.35,60.55 17.7,58.2 35.5,58.2 38.7,61.4 38.7,62.3 39.4,63 40.6,63 41.6,64 C102.P$9 44.05,64 45.05,63 47.55,63 48.55,64 C103.P$9 55.95,64 56.95,63 64.2,63 65.2,64 C104.P$9 69.55,64 70.55,63 73.95,63 74.95,64 C105.P$9 79.05,64 80.05,63 84.95,63 C106.P$9
FAB_RAB4
  L1 0.203: C101.P$10 12.55,65 14.5,65 15.75,63.75 15.75,60.7 17.9,58.55 35.25,58.55 38.25,61.55 38.25,62.4 C102.P$10 40.46,64 41.44,64.98 44.02,64.98 45,64 C103.P$10 47.55,64 48.55,65 56.05,65 57.05,64 C104.P$10 64.65,65 69.55,65 70.55,64 C105.P$10 73.9,64 74.9,65 79.05,65 80.05,64 C106.P$10
FAB_RAB5
  L1 0.203: C101.P$11 13.55,61.6 14.57,60.58 14.57,60.08 17.15,57.5 35.95,57.5 39.45,61 40.85,61 C102.P$11 44,62 45,61 48,61 C103.P$11 55.7,62 56.7,61 64.65,61 C104.P$11 69.45,62 70.45,61 74.3,61 C105.P$11 78.75,62 79.75,61 84.95,61 C106.P$11
FAB_RAB6
  L1 0.203: C101.P$12 12.53,62.98 13.96,62.98 14.95,61.99 14.95,60.35 17.45,57.85 35.7,57.85 C102.P$12 40.35,62 40.4,61.95 41.45,63 44.05,63 45.05,62 C103.P$12 47.5,62 48.5,63 55.85,63 56.85,62 C104.P$12 63.7,61.95 64.2,61.95 65.25,63 69.45,63 70.45,62 C105.P$12 73.7,62 74.7,63 79.05,63 80.05,62 C106.P$12
FM2_SPI_CS
  L6 0.203: C105.P$31 74.25,40.95 73.74,40.95 73.71,40.98 72.89,40.98 72.86,40.95 70.6,40.95 69.55,42 C104.P$31 65.04,42 64.06,41.02 63.24,41.02 62.26,42 50.39,42 49.41,42.98 46.59,42.98 45.61,42 C102.P$31
FM2_SPI_MISO
  L6 0.203: C105.P$33 74.3,39 70.3,39 69.3,40 65.75,40 C104.P$33 65.04,40 64.03,38.99 46.62,38.99 45.61,40 C102.P$33
FM2_SPI_MOSI
  L1 0.203: C102.P$32 40.46,42 41.44,42.98 49.41,42.98 50.39,42 C104.P$32
  L6 0.203: C104.P$32 64.26,42 65.26,43 69.55,43 70.55,42 C105.P$32
FM2_SPI_SCK
  L6 0.203: C105.P$34 70.4,40 69.4,41 64.95,41 63.95,40 C104.P$34 51.98,40 51,40.98 41.44,40.98 40.46,40 C102.P$34
GND  (via drill 0.35)
  L1 1.27: C101.P$14 C101.P$13 | C102.P$14 C102.P$13 C103.P$14 C103.P$13 C104.P$14 C104.P$13 C105.P$14 C105.P$13 C106.P$14 C106.P$13
  L2_GND 1.27: C104.P$14 C104.P$13 C105.P$14 C105.P$13 C106.P$14 C106.P$13 88.48,60 SP2.12 | C103.P$13 C103.P$14 C102.P$13 C102.P$14 36.7,60 32.6,64.1 | 32.6,64.1 32.6,65.5 | 23.7,62.55 23.7,60.25 | C101.P$13 C101.P$14 8.75,60 | 8.75,60 7.85,60 7.75,60.1 6.6,58.95 SP1.1 | 8.75,60 8.65,60.1 8.65,66.05 5,69.7 4.35,69.7 4.1,69.95 4.1,75.5 7.4,78.8 7.4,83.55 12.7,88.85 12.7,88.95 13,89.25 21.7,89.25 | 26.75,89.25 32.65,83.35 32.65,64.15 32.6,64.1 | 21.7,89.25 26.75,89.25 | SP5.12 21.66,89.21 21.7,89.25 | SP4.12 26.89,89.14 26.75,89.25
  L3 0.813: C101.P$13 23.65,60 24.6,60.95 35.25,60.95 36.2,60 C102.P$14
  L3 1.016: C106.P$14 C105.P$13
  L3 1.27: C101.P$14 C101.P$13 | C102.P$14 C102.P$13 C103.P$14 C103.P$13 C104.P$14 C104.P$13 | C105.P$14 C105.P$13 | C106.P$13 C106.P$14
  L4 1.27: 21.7,60 C102.P$14 C102.P$13 C103.P$14 C103.P$13 C104.P$14 C104.P$13 | 21.7,60 17.15,60 17.11,59.96 16.09,59.96 16.05,60 C101.P$13 C101.P$14 7.61,60 SP1.1 | C105.P$13 C105.P$14 | C106.P$14 C106.P$13 | SP5.1 21.66,60.04 21.7,60
  L6 0.254: T1.4 55.62,52.98 55.1,53.5 53.85,53.5 C7.2 53.77,52.12 53.8,52.1 v53.8,51.9
  L6 0.813: R6.1 R8.1 21.66,56.66 SP5.1
  L6 1.27: C101.P$13 C101.P$14 | C102.P$14 C102.P$13 C103.P$14 C103.P$13 | C104.P$14 C104.P$13 C105.P$14 C105.P$13 | C106.P$14 C106.P$13
  other vias: 12.7,79.05 12.75,74.5 16.65,74.45 29.95,82.4 30.05,79.15 16.55,71.9 68.55,84.25 74.1,84.3 78.8,84.25 71.3,81.2 77.2,81.15 81.9,80.85 64.25,78.1 59.75,78.1 55.9,78.05 42.8,78.25 38.9,81.65 35.8,84.85 6.4,63.4 16.05,11.35 65.4,6.5 69.65,6.45 75,6.45 82,6.35 52.35,11.35 56.45,11.3 4,11.65 87,11.4 89.35,11.6 84.95,6.4 81.2,31.45 81.1,34.05 51.4,43.55 53.8,43.45 44.55,68.85 44.55,70.95 80,46.05 33.75,17.35 42.45,14 45.3,13.95 56.6,31.6 56.65,29.8 51.4,39.65 51.35,36.05 51.4,33.9 61.15,65.3 53.05,66 36.9,70.85 28,71.05 18.15,77.5 35.2,78.3 64.95,88.85 69.3,88.85 74.3,88.75 80.65,88.8 89.55,61.8 86.15,21.45 34.7,66.45 9.7,6.1 93.25,11.35 93.75,64.3 92.85,83.2 58.7,15.16 61.24,15.16 63.78,15.16 66.32,15.16 68.86,15.16 71.4,15.16 73.94,15.16 76.48,15.16 58.7,17.7 61.24,17.7 63.78,17.7 66.32,17.7 68.86,17.7 71.4,17.7 73.94,17.7 76.48,17.7 58.7,20.24 61.24,20.24 63.78,20.24 66.32,20.24 68.86,20.24 71.4,20.24 73.94,20.24 76.48,20.24 18.06,11.35 20.6,11.35 23.14,11.35 25.68,11.35 28.22,11.35 30.76,11.35 33.3,11.35 35.84,11.35 18.06,13.89 20.6,13.89 23.14,13.89 25.68,13.89 28.22,13.89 30.76,13.89 33.3,13.89 35.84,13.89 18.7,93.9 21.23,93.9 23.77,93.9 26.32,93.9 28.86,93.9 31.39,93.9 33.94,93.9 62.51,93.9 65.05,93.9 67.59,93.9 70.13,93.9 72.67,93.9 75.21,93.9 77.75,93.9 16.16,2.46 18.7,2.46 21.23,2.46 23.77,2.46 26.32,2.46 28.86,2.46 31.39,2.46 33.94,2.46 62.51,2.46 65.05,2.46 67.59,2.46 70.13,2.46 72.67,2.46 75.21,2.46 77.75,2.46 80.29,2.46
  pour L2_GND (isolate 0.5): -0.3,89.3 7.3,96.9 89.3,96.9 98.35,89.05 98.35,7.45 89,-1 88.7,-0.55 6.7,-0.55 -0.9,6.7 -1,6.7 -1.2,6.9 -1.2,88.8 -0.7,89.3
  pour L1 (isolate 0.61, rank 5): 0.15,96.75 89.85,96.75 97.35,89.25 97.35,6.1 95.25,-1.4 10.2,-1.4 -2.1,6 -2.1,94.5
  pour L3 (isolate 0.305, rank 5): -2.5,97.2 94.9,97.2 96.6,95.5 97.05,95.05 97.05,5.85 89.7,-1.5 4.8,-1.5 -3,6.3 -3,96.4 -3,96.7
  pour L4 (isolate 0.406, rank 5): -0.5,97.65 91.6,97.65 99.6,89.65 99.6,5.8 91.45,-2.35 5.8,-2.35 -2.6,6.05 -2.6,95.55
  pour L6 (isolate 0.813, rank 5): -1.5,97.75 93,97.75 100.5,90.25 100.5,9.15 89.25,-2.1 6.75,-2.1 -1.65,6.3 -1.65,97.6
  pour L5_VCC (isolate 0.889): 8.89,95.25 34.29,95.25 34.29,90.17 60.96,90.17 60.96,95.25 86.36,95.25 86.36,86.36 90.17,86.36 90.17,8.89 86.36,8.89 86.36,1.27 60.96,1.27 60.96,5.08 34.29,5.08 34.29,1.27 8.89,1.27 8.89,8.89 1.27,8.89 1.27,34.29 5.08,34.29 5.08,60.96 1.27,60.96 1.27,86.36 8.89,86.36
KILL_SW
  L4 0.203: C101.P$39 14.15,33.4 37.47,33.4 39.02,34.95 40.9,34.95 C102.P$39
MPIC_ADCS_UART_RX
  L6 0.203: C104.P$44 63.7,30 | 63.7,30 64.1,30 65.1,31 69.6,31 70.6,30 C105.P$44 | C102.P$38 40.46,36 41.44,36.98 53.42,36.98 60.35,30.05 63.65,30.05 63.7,30
MPIC_ADCS_UART_TX
  L6 0.203: C105.P$43 74.3,29 70.6,29 69.6,30 65.85,30 C104.P$43 65.04,30 64.06,29.02 60.91,29.02 54.91,35.02 46.59,35.02 45.61,36 C102.P$37
MPIC_CAM_UART_RX
  L1 0.203: C105.P$28 70.85,46 69.87,46.98 64.63,46.98 C104.P$28 50.39,46 49.41,46.98 41.44,46.98 40.46,46 C102.P$28
MPIC_CAM_UART_TX
  L1 0.203: C105.P$27 74.32,45.02 70.83,45.02 69.85,46 C104.P$27 65.04,46 64.06,45.02 42.83,45.02 C102.P$27
MPIC_DATA_DIO  (via drill 0.35)
  L1 0.203: C104.P$19 64.63,52.98 63.24,52.98 60.55,50.29 v60.55,46.7
  L4 0.203: C102.P$42 40.6,32 41.48,32.88 58.08,32.88 60.5,35.3 60.5,46.65 v60.55,46.7
MPIC_DATA_UART_RX
  L1 0.203: C102.P$22 40.46,52 41.44,52.98 60.63,52.98 C104.P$18
MPIC_DATA_UART_TX
  L1 0.203: C102.P$21 45.61,52 46.59,51.02 47.7,51.02 47.83,51.02 | 47.83,51.02 47.85,51 | C104.P$17 64.63,54.98 63.24,54.98 59.28,51.02 47.83,51.02
MTQ_-X1  (via drill 0.35)
  L3 1.016: v78.2,77.8 73.65,77.8 71,74.4 71,68.9 71.9,68 C105.P$6
  L4 1.016: C106.P$6 82.6,68 80.1,70.2 80,70.5 80,75.8 v78.2,77.8
  L6 0.203: SJ4.1 71.33,69.97 C105.P$6
MTQ_-X2  (via drill 0.35)
  L3 1.016: C105.P$5 77.9,68 81.8,71.9 81.8,76.85 v80.8,77.85
  L4 1.016: C106.P$5 87.9,68 88.7,68.8 88.7,74.1 84.85,77.85 v80.8,77.85
  L6 0.203: SJ5.1 72.26,67 74.3,67 C105.P$5
MTQ_-Y1  (via drill 0.35)
  L3 1.27: C105.P$20 70.95,54 68.5,56.45 68.5,66.2 68.5,76.85 64.55,80.8 49.95,80.8 v48.9,81.85
  L6 1.27: v48.9,81.85 48.9,88.98 SP4.6
MTQ_-Y2  (via drill 0.35)
  L1 1.27: v47,84.3 46.95,84.35 SP4.7
  L3 1.27: v64.6,84.3 v47,84.3 46.95,84.3
  L6 1.27: C105.P$19 77.55,54 79.55,56 79.55,72.4 73.45,78.5 69.9,78.5 64.6,83.8 v64.6,84.3
MTQ_-Z1
  L4 1.016: C105.P$18 71.8,56 69.2,58.6 69.2,72.14 67.84,73.5 36.83,73.5 | SP5.6 21.71,73 24.6,73 25.1,73.5 36.83,73.5 | 36.83,73.5
MTQ_-Z2
  L4 1.016: SP5.7 21.82,75.2 76.3,75.2 78,73.5 78,56.9 77.1,56 C105.P$17
N$8
  L1 0.254: SW4.2 90.4,20.25 SJ2.2
N$9
  L1 0.203: 7.45,69.95 8.7,71.2 8.7,74.35 8.15,74.9
  L1 0.254: SJ1.2 4.95,68.15 6.75,69.95 7.45,69.95 | SW3.2 8.15,74.9
N$13  (via drill 0.35)
  L1 0.203: SJ3.1 18.3,20.2 24.13,26.04 v24.13,45.97
  L6 0.203: T1.1 59.43,50.38 59.05,50 54,50 53.02,50.98 28.12,50.98 24.13,46.99 v24.13,45.97
OBC_COM1
  L1 0.203: C102.P$7 44.2,66 45.2,65 47.65,65 48.65,66 C103.P$7
OBC_COM2
  L1 0.203: C103.P$8 45.4,66 44.4,67 40.85,67 C102.P$8
OBC_COM3
  L1 0.203: C103.P$43 48,29 44.9,29 43.9,30 C102.P$43
OBC_COM4
  L1 0.203: C102.P$44 40.85,31 43.85,31 44.85,30 C103.P$44
OBC_COM5
  L1 0.203: C103.P$45 48,27 44.15,27 43.15,28 C102.P$45
OBC_COM6
  L1 0.203: C103.P$46 43.85,28 42.85,29 40.85,29 C102.P$46
OBC_COM7
  L1 0.203: C102.P$47 42.85,25 48,25 C103.P$47
OBC_COM8
  L1 0.203: C103.P$48 44.45,26 43.45,27 40.85,27 C102.P$48
POWERSC_+X_NEW
  L2_GND 0.254: C101.P$27 13.4,46 12.4,47 10.4,47 8.9,45.5 8.9,45 12.55,45 C101.P$27
  L2_GND 0.61: SP1.8 8.85,44.95 8.9,45
  L2_GND 1.016: SP1.9 SP1.8
  L5_VCC 0.203: 12.1,44.95 13.15,46 C101.P$27
  L5_VCC 0.254: 10.9,46.9 11.02,46.91 | 11.02,46.91 11.93,46.91 11.93,46.9 12.5,46.9 13.4,46 C101.P$27 | 11.02,46.91 10.31,46.91 9.55,46.15 9.55,44.95 12.1,44.95
  L5_VCC 0.61: SP1.8 9.55,44.95 9.5,45
  L5_VCC 1.016: SP1.9 SP1.8
  L6 0.203: SP1.8 7.4,44.95 9.45,47 12.55,47 C101.P$27 12.55,45 8.35,45
  L6 1.016: SP1.8 6.61,45 8.35,45
  L6 1.27: SP1.8 SP1.9
POWERSC_+Y_NEW
  L5_VCC 0.254: C101.P$37 12.55,37 10.4,37 9.5,36.1 9.5,36 10.5,35 12.55,35 C101.P$37
  L5_VCC 1.016: SP3.9 SP3.8 51.05,8.15 50.25,8.95 33.55,8.95 30.35,5.75 18.85,5.75 18.02,6.58 15.16,9.44 10.78,13.82 10.78,18.32 8.2,20.9 8.2,34.7 9.5,36
  L6 1.27: SP3.8 SP3.9
POWERSC_-X_NEW  (via drill 0.35)
  L2_GND 1.016: v16.6,61.2 16.6,43 15.6,42 C101.P$31
  L5_VCC 1.016: SP2.8 SP2.9 88.35,53.05 87.6,53.8 87.6,62.45 88.35,63.2 88.35,73.45 88.45,73.55 86,76 39.6,76 23.6,60 17.8,60 v16.6,61.2
  L6 1.27: SP2.8 SP2.9
POWERSC_-Y_NEW
  L5_VCC 0.254: C101.P$21 12.55,53 10.6,53 9.6,52 10.6,51 12.55,51 C101.P$21
  L5_VCC 1.016: SP4.8 SP4.9 42.95,88.25 41.6,86.9 25.3,86.9 24.6,87.6 19.55,87.6 18.15,86.2 18.15,80.25 14.55,76.65 11.95,76.65 9.1,73.8 9.1,52.5 9.6,52
  L6 1.27: SP4.9 SP4.8
POWERSC_-Z_NEW
  L2_GND 1.016: C101.P$33 16.85,40 18.6,41.75 18.6,75.35 20.3,77.05 SP5.8 SP5.9
  L6 1.27: SP5.8 SP5.9
PROG1  (via drill 0.35)
  L1 0.203: C101.P$1 13.55,85.05 v13.8,85.3
  L6 0.203: v13.8,85.3 17.6,89.1 28.25,89.1 41.85,75.5 C102.P$1
PROG2
  L6 0.203: C102.P$2 39.85,75.5 26.88,88.47 18.32,88.47 11.55,81.7 C101.P$2
PROG3
  L1 0.203: C101.P$3 14.45,70 18.85,65.6 18.85,62.3 19.5,61.65 34.9,61.65 36.05,62.8 36.05,67.65 39.38,70.98 40.87,70.98 C102.P$3
PROG4
  L1 0.203: C101.P$4 12.55,69 14.75,69 18.4,65.35 18.4,62.1 19.3,61.2 35.45,61.2 36.55,62.3 36.55,67.35 39.2,70 C102.P$4
PROG5
  L1 0.203: C102.P$5 40.85,69 38.95,69 37.05,67.1 37.05,62.15 35.65,60.75 19,60.75 17.9,61.85 17.9,64.85 14.75,68 C101.P$5
PROG6
  L1 0.203: C102.P$6 37.6,65.75 37.6,61.8 36.1,60.3 18.65,60.3 17.4,61.55 17.4,64.75 15.15,67 12.55,67 C101.P$6
RAW_POWER
  L1 1.27: C101.P$30 C101.P$29 | C102.P$29 C102.P$30
  L3 1.27: C102.P$30 C102.P$29 | C101.P$30 C101.P$29
  L4 1.27: C102.P$29 C102.P$30 | C101.P$29 C101.P$30
  L4 2: C101.P$29 C102.P$30
  L5_VCC 1.016: C102.P$29 C102.P$30 | C101.P$29 C101.P$30
  L5_VCC 2: C101.P$29 C102.P$30
  L6 0.813: C101.P$29 16.6,44 18.8,46.2 18.77,46.23 R5.1 R7.1
  L6 1.27: C102.P$30 C102.P$29 | C101.P$30 C101.P$29
SUP5V0
  L1 1.27: C101.P$15 C101.P$16 | C102.P$16 C102.P$15 C103.P$16 C103.P$15 C104.P$16 C104.P$15 C105.P$16 C105.P$15 C106.P$16 C106.P$15
  L2_GND 1.27: C101.P$16 C101.P$15 | C102.P$16 C102.P$15 C103.P$16 C103.P$15 | C104.P$16 C104.P$15 | C105.P$16 C105.P$15 | C106.P$16 C106.P$15
  L3 1.016: C105.P$15 C106.P$16
  L3 1.27: C101.P$16 C101.P$15 C102.P$16 C102.P$15 C103.P$16 C103.P$15 C104.P$16 C104.P$15 | C105.P$16 C105.P$15 | C106.P$16 C106.P$15
  L4 1.27: C101.P$16 C101.P$15 C102.P$16 C102.P$15 C103.P$16 C103.P$15 C104.P$16 C104.P$15 | C105.P$15 C105.P$16 | C106.P$15 C106.P$16
  L5_VCC 1.016: C106.P$15 C106.P$16 C105.P$15 C105.P$16 C104.P$15 C104.P$16 C103.P$15 C103.P$16 C102.P$15 C102.P$16 C101.P$15 C101.P$16
  L6 1.27: C101.P$16 C101.P$15 | C102.P$16 C102.P$15 C103.P$16 C103.P$15 | C105.P$15 C105.P$16 C104.P$15 C104.P$16 | C106.P$16 C106.P$15
SUP_3V3_1  (via drill 0.35)
  L1 1.27: C102.P$50 C102.P$49 C103.P$50 C103.P$49 | C104.P$50 C104.P$49 C105.P$50 C105.P$49 C106.P$50 C106.P$49 | C101.P$50 C101.P$49
  L2_GND 1.27: C102.P$50 C102.P$49 C103.P$50 C103.P$49 54.75,24 58.9,28.15 58.9,70.95 50.55,79.3 45.6,79.3 42.75,82.15 v42.75,83.25 | C104.P$50 C104.P$49 | C106.P$50 C106.P$49
  L3 1.016: C101.P$49 19.5,18.05 29.3,18.05 33.3,22.05 37.9,22.05 C102.P$50 | 54.5,24 54.5,16.2 59,11.7 59.25,11.95 76.45,11.95 81.6,17.1 81.6,24
  L3 1.27: C106.P$49 C106.P$50 81.6,24 C105.P$49 C105.P$50 | C102.P$50 C102.P$49 C103.P$50 C103.P$49 54.5,24 C104.P$50 | C101.P$50 C101.P$49
  L4 0.508: C101.P$49 19.95,24 21.3,25.35 21.3,26.05 21.91,26.66 28.66,26.66 29.16,26.16 29.16,26.14 30.8,24.5 39.35,24.5 C102.P$50
  L4 1.27: C106.P$49 C106.P$50 | C105.P$49 C105.P$50 C104.P$49 C104.P$50 | C101.P$50 C101.P$49 | C102.P$50 C102.P$49 C103.P$50 C103.P$49
  L5_VCC 0.508: SP1.2 5.65,56.95 5,57.7 5,79.1 16.9,91 | 39.05,23.95 39,24 | SP4.2 56.95,87.05 55.7,85.8 45.3,85.8 v42.75,83.25 24.55,65.05 SP5.2 | SP3.2 39.05,5.95 40,5 77.8,5 84,11.2
  L5_VCC 0.61: C106.P$49 87.95,26 87.95,38.2 88.8,39.05 SP2.2 90.3,39.05 90.78,39.52 90.78,77.92 88.4,80.3 86.55,80.3 76.17,90.68 57.66,90.68 56.95,89.97 SP4.2 56.95,89.86 56.13,90.68 34.8,90.68 34.48,91 16.9,91
  L5_VCC 0.813: C106.P$50 84,23.95 84,11.2 | C106.P$49 86,24.05
  L5_VCC 1.016: 39,24 C102.P$50 | C106.P$49 C106.P$50 C105.P$49 C105.P$50 C104.P$49 C104.P$50 C103.P$49 C103.P$50 C102.P$49 C102.P$50 | C101.P$50 C101.P$49 19.7,17.85 29.85,17.85 36,24 C102.P$50
  L6 0.508: v42.75,83.25 42.75,83.2 55.62,70.33 55.62,60.45 53.77,58.61 C7.1 | C7.1 55.39,56.49 T1.5 | C7.1 54.04,54.61 58.34,54.61 59.43,55.7 T1.8
  L6 1.016: C104.P$49 C105.P$50 | C105.P$49 C106.P$50
  L6 1.27: C101.P$50 C101.P$49 | C102.P$50 C102.P$49 | C103.P$50 C103.P$49 | C104.P$50 C104.P$49 | C105.P$50 C105.P$49 | C106.P$50 C106.P$49
SUP_3V3_2
  L1 1.27: C104.P$26 C104.P$25 C105.P$26 C105.P$25 C106.P$26 C106.P$25 | C102.P$26 C102.P$25 C103.P$26 C103.P$25 | C101.P$26 C101.P$25
  L3 1.27: C101.P$26 C101.P$25 | C102.P$26 C102.P$25 C103.P$26 C103.P$25 C104.P$26 C104.P$25 C105.P$26 C105.P$25 | C106.P$25 C106.P$26
  L4 1.27: C101.P$26 C101.P$25 C102.P$26 C102.P$25 C103.P$26 C103.P$25 C104.P$26 C104.P$25 C105.P$26 C105.P$25
  L5_VCC 1.016: C101.P$26 C101.P$25 | C102.P$26 C102.P$25 C103.P$26 C103.P$25 C104.P$26 C104.P$25 C105.P$26 C105.P$25 C106.P$26 C106.P$25
  L6 1.27: C102.P$26 C102.P$25 C103.P$26 C103.P$25 C104.P$26 C104.P$25 C105.P$26 C105.P$25 C106.P$26 C106.P$25 | C101.P$26 C101.P$25
SUP_UNREG_1
  L1 1.27: C101.P$24 C101.P$23 | C106.P$23 C106.P$24 C105.P$23 C105.P$24 C104.P$23 C104.P$24 | C103.P$23 C103.P$24 | C102.P$23 C102.P$24
  L2_GND 1.27: C101.P$24 C101.P$23
  L3 1.27: C101.P$24 C101.P$23 | C102.P$24 C102.P$23 C103.P$24 C103.P$23 C104.P$24 C104.P$23 C105.P$24 C105.P$23 | C106.P$23 C106.P$24
  L4 1.27: C101.P$24 C101.P$23 C102.P$24 C102.P$23 C103.P$24 C103.P$23 C104.P$24 C104.P$23 C105.P$24 C105.P$23
  L5_VCC 1.016: C101.P$24 C101.P$23 C102.P$24 C102.P$23 C103.P$24 C103.P$23 C104.P$24 C104.P$23 C105.P$24 C105.P$23 C106.P$24 C106.P$23
  L6 1.27: C101.P$24 C101.P$23 | C102.P$24 C102.P$23 | C104.P$24 C104.P$23 C105.P$24 C105.P$23 C106.P$24 C106.P$23 | C103.P$23 C103.P$24
SUP_UNREG_2
  L1 1.27: C101.P$36 C101.P$35 | C102.P$36 C102.P$35 C103.P$36 C103.P$35 | C104.P$36 C104.P$35 C105.P$36 C105.P$35 | C106.P$36 C106.P$35
  L3 1.27: C106.P$35 C106.P$36 C105.P$35 C105.P$36 C104.P$35 C104.P$36 C103.P$35 C103.P$36 | C102.P$35 C102.P$36 | C101.P$36 C101.P$35
  L4 1.27: C106.P$35 C106.P$36 C105.P$35 C105.P$36 C104.P$35 C104.P$36 | C103.P$36 C103.P$35 | C102.P$35 C102.P$36 | C101.P$36 C101.P$35
  L5_VCC 1.016: C102.P$35 43.1,38 44,38.9 45.25,38.9 46.15,38 C103.P$36 C103.P$35 C104.P$36 C104.P$35 C105.P$36 C105.P$35 C106.P$36 C106.P$35
  L5_VCC 1.27: C101.P$36 C101.P$35 | C102.P$36 C102.P$35
  L5_VCC 2: C101.P$35 C102.P$36
  L6 1.016: C104.P$36 C104.P$35 C105.P$36 C105.P$35 C106.P$36 C106.P$35 | C103.P$35 C103.P$36 | C102.P$35 C102.P$36 | C101.P$36 C101.P$35
TEMP1_+X_NEW
  L3 0.254: SP1.10 7.65,40.95 9.5,42.8 9.5,44.9 10.6,46 C101.P$28
TEMP2_-Y_NEW
  L3 0.254: C101.P$22 10.5,52 9.4,53.1 9.4,84.4 12.75,87.75 40.35,87.75 40.95,88.35 SP4.10
TEMP3_-Z_NEW  (via drill 0.35)
  L3 0.254: C101.P$34 10.2,40 9.2,39 9.2,36.4 7.4,34.6 5.9,34.6 4.9,35.6 4.9,36.83 v4.9,81.2 | SP5.10 10.95,81.05 10.79,81.2 v10.6,81.2
  L4 0.254: v10.6,81.2 7.9,81.2 v4.9,81.2
TEMP4_+Y_NEW
  L3 0.254: SP3.10 55.05,5.75 54.2,4.9 17.57,4.9 6.6,15.88 6.6,32.4 10.2,36 C101.P$38
TEMP5_-X_NEW
  L3 0.254: C101.P$32 12.55,41 14.4,41 15.1,40.3 15.1,36.15 13.95,35 10.7,35 7.6,31.9 7.6,16.95 14.5,10.05 81.25,10.05 90.8,19.6 90.8,53.38 SP2.10

### Text on the board
tPlace: SW3 | SW2 | SW4 | SW1
tNames: +x | 1 | +Y | 1 | 1 | 5 | 5 | 5 | 1 | GND | GND | GND | GND | 15 | 5V0 | 15 | 5V0 | 15 | 5V0 | UNREG1 | UNREG1 | UNREG1 | 25 | 3V3_2 | 25 | 3V3_2 | 25 | 3V3_2 | RAW PWR | 35 | 35 | UNREG2 | 35 | UNREG2 | 1 | 45 | 45 | 45 | 1 | 3V3_1 | 3V3_1 | 1 | BIRDS 3 FM HBPB / SRI LANKA NEPAL | PCB No........... | 1 | LaSEINE, Kyutech | BIRDS 3
bNames: 1 | BIRDS 3 FM HBPB / SRI LANKA NEPAL | PCB No........... | Designed in Eagle by Abhas | 04.10.2018